# Altium schematic sheet Power.SchDoc
size B
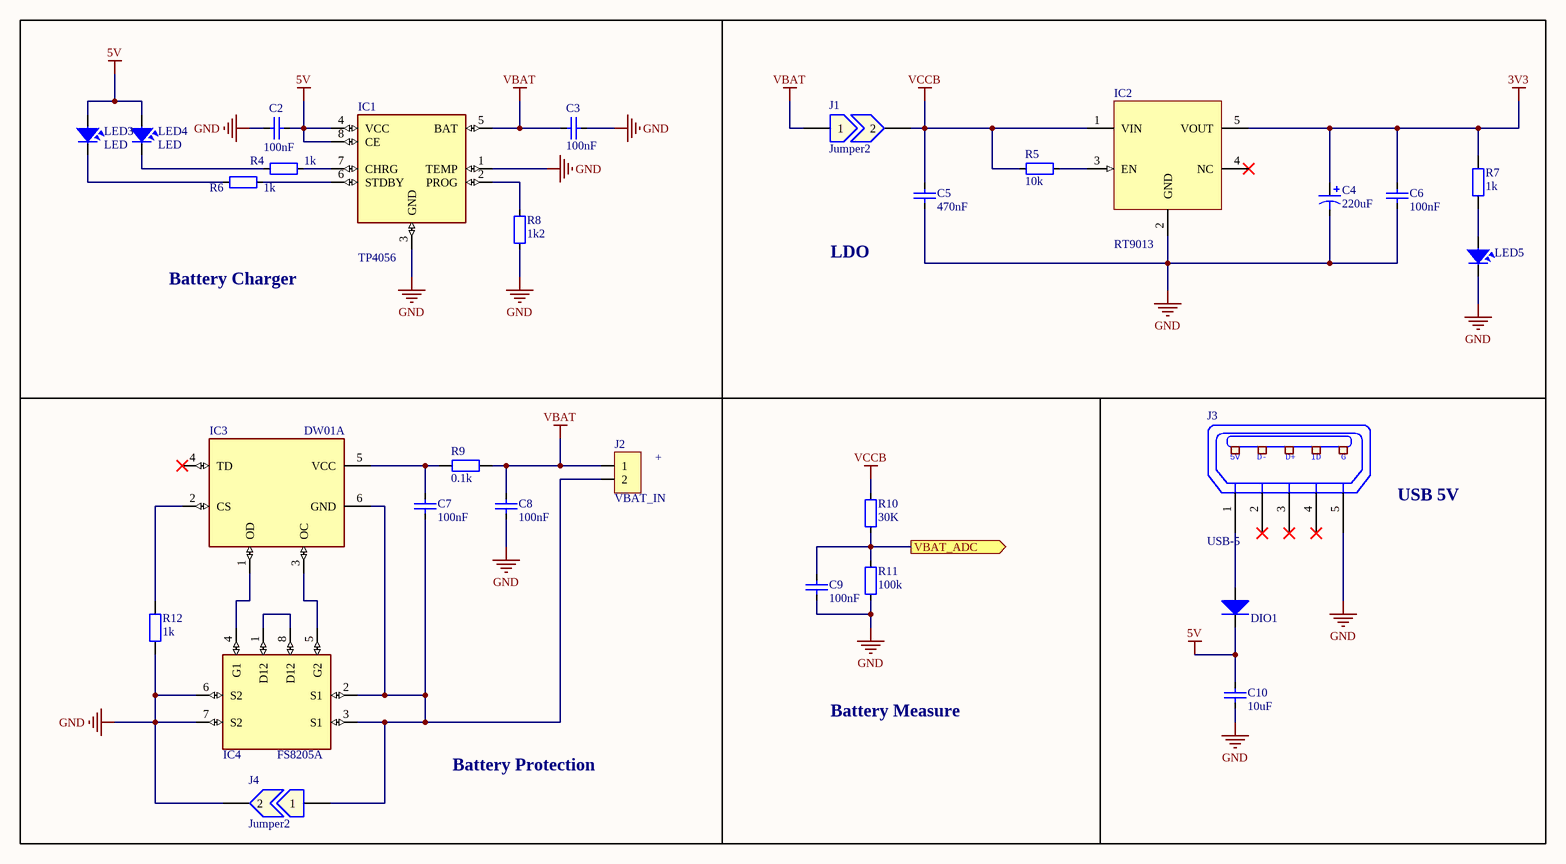
[diagram p0: Power.SchDoc]

## Parts
C2  100nF  [CAP_0805]
C3  100nF  [CAP_0805]
C4  220uF  [CAP_TANTALUM_3216]
C5  470nF  [CAP_0805]
C6  100nF  [CAP_0805]
C7  100nF  [CAP_0805]
C8  100nF  [CAP_0805]
C9  100nF  [CAP_0805]
C10  10uF  [CAP_0805]
DIO1  Diode SMD  [DIO-214AC(SMA)]  (value not drawn)
IC1  TP4056  [TP4056]
IC2  RT9013  [SOT23-5]
IC3  DW01A  [SOT23-6]
IC4  FS8205A  [FS8205A]
J1  Jumper2  [JUMPER2]
J2  VBAT_IN  [JP2-D1T]
J3  USB-5  [USB-M1]
J4  Jumper2  [JUMPER2]
LED3  LED  [LED-0805-Red]
LED4  LED  [LED-0805-Green]
LED5  (no value)  [LED-0805-Red]
R4  1k  [RES-SMD-0805]
R5  10k  [RES-SMD-0805]
R6  1k  [RES-SMD-0805]
R7  1k  [RES-SMD-0805]
R8  1k2  [RES-SMD-0805]
R9  0.1k  [RES-SMD-0805]
R10  30K  [RES-SMD-0805]
R11  100k  [RES-SMD-0805]
R12  1k  [RES-SMD-0805]

## Ports
VBAT_ADC (out)

## Nets
3V3: C4.1 C6.1 IC2.5(VOUT) R7.2
5V: C2.1 C10.2 DIO1.2(K) IC1.4(VCC) IC1.8(CE) LED3.1 LED4.1
GND: C2.2 C3.1 C4.2 C5.2 C6.2 C8.1 C9.1 C10.1 IC1.1(TEMP) IC1.3(GND) IC2.2(GND) IC4.6(S2) IC4.7(S2) J3.5(P5) J4.2 LED5.2 R8.1 R11.2 R12.2
VBAT: C3.2 C8.2 IC1.5(BAT) J1.1 J2.1 R9.2
VCCB: C5.1 IC2.1(VIN) J1.2 R5.2 R10.1
VBAT_ADC: C9.2 R10.2 R11.1 ; port VBAT_ADC
NetC7_1: C7.1 IC3.6(GND) IC4.2(S1) IC4.3(S1) J2.2 J4.1
NetC7_2: C7.2 IC3.5(VCC) R9.1
NetDIO1_1: DIO1.1(A) J3.1(P1)
NetIC1_2: IC1.2(PROG) R8.2
NetIC1_6: IC1.6(STDBY) R6.1
NetIC1_7: IC1.7(CHRG) R4.1
NetIC2_3: IC2.3(EN) R5.1
NetIC3_1: IC3.1(OD) IC4.4(G1)
NetIC3_2: IC3.2(CS) R12.1
NetIC3_3: IC3.3(OC) IC4.5(G2)
NetIC4_1: IC4.1(D12) IC4.8(D12)
NetLED3_2: LED3.2 R6.2
NetLED4_2: LED4.2 R4.2
NetLED5_1: LED5.1 R7.1

Not connected (* = marked no-connect by the designer): IC2 4(NC)*; IC3 4(TD)*; J3 2(P2)* 3(P3)* 4(P4)*

## Notes on the sheet
- Battery Charger
- LDO
- (near J2) +
- USB 5V
- Battery Measure
- Battery Protection
- (in symbol USB-5) 5V; D-; D+; ID; G

## Library data of the parts
C2 C3 C5-C10 = CapSMD: Capacitor; Value: 33p; Published: 8-Jun-2000; LatestRevisionDate: 17-Jul-2002; LatestRevisionNote: Re-released for DXP Platform.; PackageReference: RAD-0.3; Publisher: Altium Limited
C4 = Cap Pol: Polarized Capacitor (Axial); Published: 8-Jun-2000; LatestRevisionDate: 17-Jul-2002; LatestRevisionNote: Re-released for DXP Platform.; PackageReference: POLAR0.8; Publisher: Altium Limited
DIO1 = Diode SMD: Default Diode; Code - JEDEC: DO-214-AB; Value: 1N5007; Published: 8-Jun-2000; Revision: July-2002: Re-released for DXP Platform.; Publisher: Altium Limited
IC1 = TP4056: Complete single cell Li-Ion battery with a constant current / constant voltage linear charger
IC2 = RT9013: https://linhkien.cxt.vn/5435-rt9013-33gb-ic-reg-linear-33v-500ma-sot23-5.html
IC3 = DW01A: One Cell Lithium-ion/Polymer Battery Protection IC
J1 J4 = Jumper2: Jumper, 2-Pin
J2 = JP2: WR-PHD 2.54 mm Angled Socket Header; Manufacturer: W¨¹rth Elektronik eiSos GmbH; partNo: 613002143121; ComponentLink1 Description: Manufacturer; ComponentLink2 Description: Datasheet; NoPins: 02; Created Date: 29 March 2013; ComponentLink1URL: http://www.we-online.com; ComponentLink2URL: http://katalog.we-online.de/em/datasheet/6130xx143121.pdf; Created by: Karrer Zheng
J3 = USB-5: Manufacturer: FCI; Manufacturer Part Number: 10118193-0001LF; Connector Type: USB - micro B; Number of Contacts: 5; Gender: Receptacle; Specifications: USB 2.0; .Creator: MM; .Checked PCB: RF; Supplier 1: Digi-Key; RoHS: RoHS Compliant; Category: Connectors, Interconnects; Stock 1: 28642; Pricing 1: 1=0.46, 10=0.433, 25=0.3712, 50=0.3156, 100=0.3032, 250=0.27224, 500=0.25988 (USD); Packaging: Cut Tape (CT); Mounting Type: Surface Mount, Right Angle, Horizontal; Features: Shielded, Solder Retention; Ingress Protection: -; ComponentLink1URL: http://portal.fciconnect.com/Comergent//fci/drawing/10118193.pdf; ComponentLink1Description: http://portal.fciconnect.com/Comergent//fci/drawing/10118193.pdf; Supplier Part Number 1: 609-4616-1-ND; .Checked SCH: MM
LED3-LED5 = LED: LED Single colour Green and Red; Value: LED 3 ly Single Colour
R4-R6 R8 R10 R11 = Resistor - SMD: Resistor; Manufacturer: Generic Components; Class: Passive; Published: 08/06/2000; Publisher: Altium Hobart Technology Centre
R7 R9 R12 = Resistor - SMD: Resistor SMD; Manufacturer: Generic Components; Class: Passive; Published: 08/06/2000; Publisher: Altium Hobart Technology Centre